# Altium schematic sheet Power.SchDoc: Power Section
size Tabloid; DocumentNumber: 3; SheetNumber: 3; SheetTotal: 3
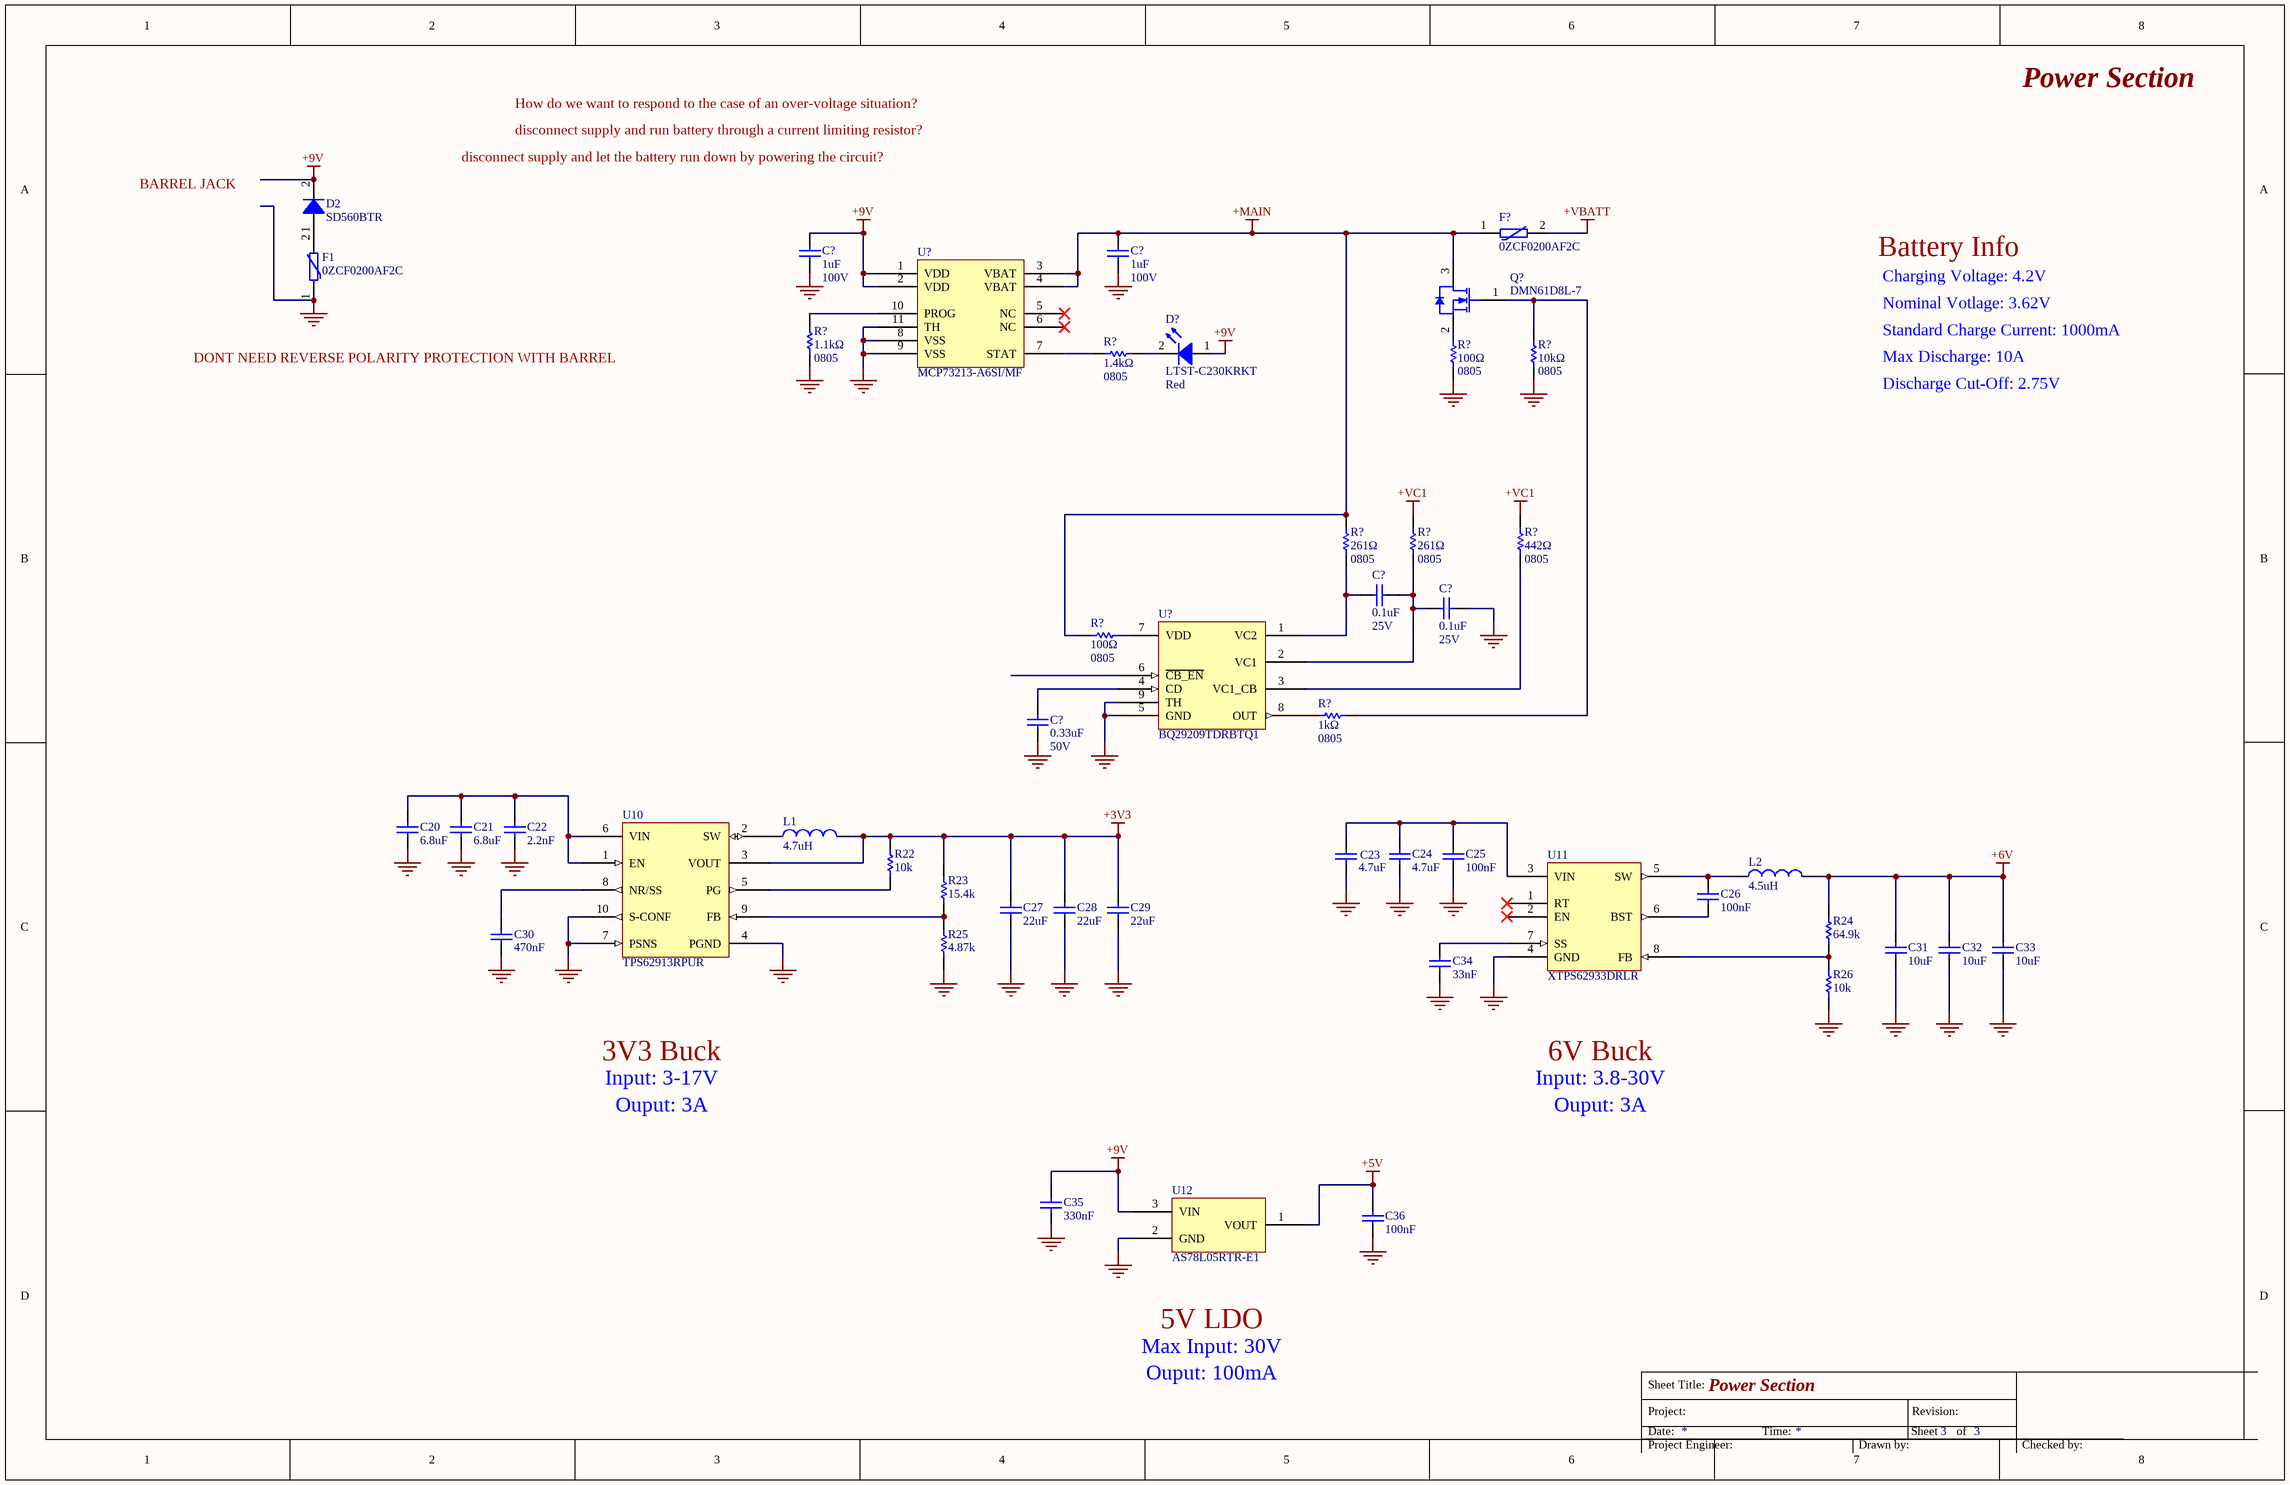
[diagram p0: Power.SchDoc]

## Parts
(Parts that share a designator on the sheet are numbered #1, #2 ... from top to bottom, then left to right.)
C20  6.8uF  [C0603]
C21  6.8uF  [C0603]
C22  2.2nF  [C0402]
C23  4.7uF  [C0805]
C24  4.7uF  [C0805]
C25  100nF  [C0402]
C26  100nF  [C0402]
C27  22uF  [C0603]
C28  22uF  [C0603]
C29  22uF  [C0603]
C30  470nF  [C0402]
C31  10uF  [C0805]
C32  10uF  [C0805]
C33  10uF  [C0805]
C34  33nF  [C0402]
C35  330nF  [C0402]
C36  100nF  [C0402]
C?#1  value 1uF  Voltage: 100V  [C0805]  (hidden comment: Ceramic Cap)
C?#2  value 1uF  Voltage: 100V  [C0805]  (hidden comment: Ceramic Cap)
C?#3  value 0.1uF  Voltage: 25V  [C0805]  (hidden comment: Ceramic Cap)
C?#4  value 0.1uF  Voltage: 25V  [C0805]  (hidden comment: Ceramic Cap)
C?#5  value 0.33uF  Voltage: 50V  [C0805]  (hidden comment: Ceramic Cap)
D2  SD560BTR  [DIOM4436X26N]
D?  Color: Red  [LTST-C230KRKT]  (hidden comment: LED)
F1  0ZCF0200AF2C  [RESC7451X08N]
F?  0ZCF0200AF2C  [RESC7451X08N]
L1  4.7uH  [SPM6530T-4R7M]
L2  4.5uH  [SRR1208-4R5ML]
Q?  DMN61D8L-7  [SOT90P240X102-3N]
R22  10k  [RESC1005X04N]
R23  15.4k  [RESC1005X04N]
R24  64.9k  [RESC1005X04N]
R25  4.87k  [RESC1005X04N]
R26  10k  [RESC1005X04N]
R?#1  value 1.1kΩ  Package/Footprint: 0805  [R0805]  (hidden comment: Resistor)
R?#2  value 1.4kΩ  Package/Footprint: 0805  [R0805]  (hidden comment: Resistor)
R?#3  value 100Ω  Package/Footprint: 0805  [R0805]  (hidden comment: Resistor)
R?#4  value 10kΩ  Package/Footprint: 0805  [R0805]  (hidden comment: Resistor)
R?#5  value 261Ω  Package/Footprint: 0805  [R0805]  (hidden comment: Resistor)
R?#6  value 261Ω  Package/Footprint: 0805  [R0805]  (hidden comment: Resistor)
R?#7  value 442Ω  Package/Footprint: 0805  [R0805]  (hidden comment: Resistor)
R?#8  value 100Ω  Package/Footprint: 0805  [R0805]  (hidden comment: Resistor)
R?#9  value 1kΩ  Package/Footprint: 0805  [R0805]  (hidden comment: Resistor)
U10  TPS62913RPUR  [TPS62913RPUR]
U11  XTPS62933DRLR  [XTPS62933DRLR]
U12  AS78L05RTR-E1  [SOT89-150P350X160-3N]
U?#1  MCP73213-A6SI/MF
U?#2  BQ29209TDRBTQ1

## Nets
+3V3: C27.2 C28.2 C29.2 L1.2 R22.2 R23.2 U10.3(VOUT)
+5V: C36.2 U12.1(VOUT)
+6V: C31.2 C32.2 C33.2 L2.2 R24.2
+9V: C35.2 C?#1.2 D2.2(K) D?.1(A) U12.3(VIN) U?#1.1(VDD) U?#1.2(VDD)
+MAIN: C?#2.2 F?.1(A) Q?.3(D) R?#5.2 R?#8.1 U?#1.3(VBAT) U?#1.4(VBAT)
+VBATT: F?.2(K)
+VC1: R?#6.2 R?#7.2
GND: C20.1 C21.1 C22.1 C23.1 C24.1 C25.1 C27.1 C28.1 C29.1 C30.1 C31.1 C32.1 C33.1 C34.1 C35.1 C36.1 C?#1.1 C?#2.1 C?#4.2 C?#5.1 F1.1(A) R25.1 R26.1 R?#1.1 R?#3.1 R?#4.1 U10.4(PGND) U10.7(PSNS) U10.10(S-CONF) U11.4(GND) U12.2(GND) U?#1.8(VSS) U?#1.9(VSS) U?#1.11(TH) U?#2.5(GND) U?#2.9(TH)
NetC20_2: C20.2 C21.2 C22.2 U10.1(EN) U10.6(VIN)
NetC23_2: C23.2 C24.2 C25.2 U11.3(VIN)
NetC26_1: C26.1 U11.6(BST)
NetC26_2: C26.2 L2.1 U11.5(SW)
NetC30_2: C30.2 U10.8(NR/SS)
NetC34_2: C34.2 U11.7(SS)
NetC?#3_1: C?#3.1 R?#5.1 U?#2.1(VC2)
NetC?#3_2: C?#3.2 C?#4.1 R?#6.1 U?#2.2(VC1)
NetC?#5_2: C?#5.2 U?#2.4(CD)
NetD2_1: D2.1(A) F1.2(K)
NetD?_2: D?.2(K) R?#2.2
NetL1_1: L1.1 U10.2(SW)
NetQ?_1: Q?.1(G) R?#4.2 R?#9.2
NetQ?_2: Q?.2(S) R?#3.2
NetR22_1: R22.1 U10.5(PG)
NetR23_1: R23.1 R25.2 U10.9(FB)
NetR24_1: R24.1 R26.2 U11.8(FB)
NetR?#1_2: R?#1.2 U?#1.10(PROG)
NetR?#2_1: R?#2.1 U?#1.7(STAT)
NetR?#7_1: R?#7.1 U?#2.3(VC1_CB)
NetR?#8_2: R?#8.2 U?#2.7(VDD)
NetR?#9_1: R?#9.1 U?#2.8(OUT)

Not connected (* = marked no-connect by the designer): U11 1(RT)* 2(EN)*; U?#1 5(NC)* 6(NC)*; U?#2 6(~{CB_EN})

## Notes on the sheet
- disconnect supply and let the battery run down by powering the circuit?
- How do we want to respond to the case of an over-voltage situation?
- disconnect supply and run battery through a current limiting resistor?
- BARREL JACK
- Charging Voltage: 4.2V
- Battery Info
- DONT NEED REVERSE POLARITY PROTECTION WITH BARREL
- Nominal Votlage: 3.62V
- Standard Charge Current: 1000mA
- Max Discharge: 10A
- Discharge Cut-Off: 2.75V
- 3V3 Buck
- Input: 3-17V
- Ouput: 3A
- 6V Buck
- Input: 3.8-30V
- 5V LDO
- Max Input: 30V
- Ouput: 100mA
- Sheet Title:
- Date:
- Project:
- Time:
- Sheet
- Revision:
- of
- Project Engineer:
- Drawn by:
- Checked by:

## Library data of the parts
C20 C21 = C1608JB1E685M080AC: General Purpose MLCC, 0603, JB, 25V, 6.8 F, 20%, 0.80mm; Manufacturer: TDK; Part Number: C1608JB1E685M080AC; Supplier 1: Digi-Key; Supplier Part Number 1: 445-11258-1-ND; Manufacturer Part Number: C1608JB1E685M080AC; Stock 1: 1791; Pricing 1: 1=0.67000, 10=0.47200, 50=0.35640, 100=0.31050, 500=0.23000, 1000=0.19550 (USD); Mount: Surface Mount; Case/Package: 0603; Case Code (Metric): 1608; Case Code (Imperial): 0603; Capacitance: 6.8uF; RoHS: Yes; Category: Ceramic Capacitors
C22 = C0402C222J3GEC7867: CAP CER 0402 2.2NF 25V C0G 5%; Manufacturer: KEMET; Part Number: C0402C222J3GEC7867; Supplier 1: Digi-Key; Supplier Part Number 1: 399-C0402C222J3GEC7867CT-ND; Manufacturer Part Number: C0402C222J3GEC7867; Stock 1: 6454; Pricing 1: 1=0.17000, 10=0.12300, 50=0.07000, 100=0.05800, 500=0.04068, 1000=0.03368, 2500=0.03135, 5000=0.02868 (USD); Capacitance: 2.2nF; RoHS: No; Category: Ceramic Capacitors
C23 C24 = CL21A475KOFNNNG: 4.7µF Ceramic Capacitor 16V % Samsung Electro-Mechanics CL21A475KOFNNNG; Tolerance: 10%; Dielectric: X5R; Part Number: CL21A475KOFNNNG; Supplier 1: Digi-Key; Supplier Part Number 1: 1276-6463-6-ND; Manufacturer: Samsung; Manufacturer Part Number: CL21A475KOFNNNG; Stock 1: 16459; Pricing 1: 1=0.12, 10=0.084, 100=0.0394, 500=0.0276, 1000=0.0229 (USD); Case/Package: 0805; Case Code (Metric): 2012; Case Code (Imperial): 0805; Min Operating Temperature: -55°C; Max Operating Temperature: 85°C; Capacitance: 4.7uF; Packaging: Tape and Reel; Voltage Rating: 16V; Length: 2mm; Height: 1.25mm; Width: 0.049inch; Thickness: 0.053inch; Depth: 1.25mm; Radiation Hardening: No
C25 C26 C36 = CL05A104KA5NNNC: Ceramic Capacitor, Multilayer, Ceramic, 25V, 10% +Tol, 10% -Tol, X5R, 15% TC, 0.1uF, Surface Mount, 0402; Manufacturer: Samsung; Part Number: CL05A104KA5NNNC; Supplier 1: Digi-Key; Supplier Part Number 1: 1276-1043-1-ND; Manufacturer Part Number: CL05A104KA5NNNC; Capacitance: 100nF
C27-C29 = CL10A226MPMNUBE: Ceramic Capacitor, Multilayer, Ceramic, 10V, 20% +Tol, 20% -Tol, X5R, 15% TC, 22uF, Surface Mount, 0603; Manufacturer: Samsung; Part Number: CL10A226MPMNUBE; Supplier 1: Digi-Key; Supplier Part Number 1: 1276-6751-2-ND; Manufacturer Part Number: CL10A226MPMNUBE; Mount: Surface Mount; Capacitance: 22uF
C30 = C0402C474K8RACTU: 0.47 µF ±10% 10V Ceramic Capacitor X7R 0402 (1005 Metric); Manufacturer: KEMET; Part Number: C0402C474K8RACTU; Supplier 1: Digi-Key; Supplier Part Number 1: 399-C0402C474K8RACTUCT-ND; Manufacturer Part Number: C0402C474K8RACTU; Stock 1: 12286; Pricing 1: 1=0.55000, 10=0.38900, 50=0.29440, 100=0.25650, 500=0.18998, 1000=0.16148, 2500=0.15198, 5000=0.14248 (USD); Capacitance: 470nF; RoHS: Yes; Category: Ceramic Capacitors
C31-C33 = CL21A106KAYNNNG: Ceramic Capacitor, Multilayer, Ceramic, 25V, 10% +Tol, 10% -Tol, X5R, 15% TC, 10uF, Surface Mount, 0805; Manufacturer: Samsung; Part Number: CL21A106KAYNNNG; Supplier 1: Digi-Key; Supplier Part Number 1: 1276-6454-6-ND; Manufacturer Part Number: CL21A106KAYNNNG; Mount: Surface Mount; Capacitance: 10uF
C34 = CGA2B3X7R1H333K050BB: CAP CER 0.033UF 50V X7R 0402; Manufacturer: TDK; Part Number: CGA2B3X7R1H333K050BB; Supplier 1: Digi-Key; Supplier Part Number 1: 445-6896-1-ND; Manufacturer Part Number: CGA2B3X7R1H333K050BB; Stock 1: 236424; Pricing 1: 1=0.11000, 10=0.07900, 50=0.04280, 100=0.03500, 500=0.02502, 1000=0.01966, 2500=0.01788, 5000=0.01644 (USD); Mount: Surface Mount; Case/Package: 0402; Case Code (Metric): 1005; Case Code (Imperial): 0402; Capacitance: 33nF; RoHS: Yes; Category: Ceramic Capacitors
C35 = C1005JB1V334M050BC: CAP CER 0.33UF 35V JB 0402; Manufacturer: TDK; Tolerance: 20%; Dielectric Material: Ceramic; Part Number: C1005JB1V334M050BC; Supplier 1: Digi-Key; Supplier Part Number 1: 445-11021-1-ND; Manufacturer Part Number: C1005JB1V334M050BC; Stock 1: 16942; Pricing 1: 1=0.18000, 10=0.12800, 50=0.07240, 100=0.06000, 500=0.04208, 1000=0.03484, 2500=0.03243, 5000=0.02967 (USD); Mount: Surface Mount; Case/Package: 0402; Case Code (Metric): 1005; Case Code (Imperial): 0402; Min Operating Temperature: -25°C; Max Operating Temperature: 85°C; Capacitance: 330nF; Packaging: Tape and Reel; Voltage Rating: 35V; RoHS: Yes; Category: Ceramic Capacitors; Weight: 0.001199oz; Package Quantity: 10000
C?#1 C?#2 = 08051C105K4Z2A: Manufacturer: KYOCERA AVX; Part Number: 08051C105K4Z2A; Package: 0805; Supplier: Digi-Key; Supplier Part Number: 478-12143-1-ND; Voltage Rating: 100V; Capacitance: 1uF
C?#3 C?#4 = CL21B104KACNNNC: Manufacturer: Samsung Electro-Mechanics; Part Number: CL21B104KACNNNC; Package: 0805; Supplier: Digi-Key; Supplier Part Number: 1276-1099-1-ND; Voltage Rating: 25V; Capacitance: 0.1uF
C?#5 = CL21B334KBFNFNE: Manufacturer: Samsung Electro-Mechanics; Part Number: CL21B334KBFNFNE; Package: 0805; Supplier: Digi-Key; Supplier Part Number: 1276-2959-1-ND; Voltage Rating: 50V; Capacitance: 0.33uF
D2 = SD560BTR: Diode Gen Purp 600V 5A Smb; Manufacturer: SMC; Part Number: SD560BTR; Manufacturer Part Number: SD560BTR; Pricing 1: 3000=0.08080, 9000=0.06710, 15000=0.06640, 30000=0.06550, 60000=0.06460 (USD); Supplier 1: Future Electronics; Supplier Part Number 1: 4059436; RoHS: No; Category: Industrial Control
D? = LTST-C230KRKT: Vf: 2V; Manufacturer Part Number: LTST-C230KRKT; Part Number: LTST-C230KRKT; Colour: Red; Size: 3.20mm L x 1.60mm W; Supplier: Digi-Key; Supplier Part Number: 160-1457-1-ND
F1 F? = 0ZCF0200AF2C: PTC RESET FUSE 24V 2A 2920; Manufacturer: Bel; Part Number: 0ZCF0200AF2C; Supplier 1: Digi-Key; Supplier Part Number 1: 507-1749-1-ND; Manufacturer Part Number: 0ZCF0200AF2C; Stock 1: 88016; Pricing 1: 1=0.26000, 5=0.24800, 10=0.23700, 50=0.21160, 100=0.19710, 250=0.17520, 500=0.14600, 1000=0.13870 (USD); Case Code (Metric): 7351; Case Code (Imperial): 2920; RoHS: Yes; Category: PTC Resettable Fuses
L1 = SPM6530T-4R7M: Ind Power Shielded Wirewound 4.7uH 20% 100KHz Metal 5.6A T/R; Manufacturer: TDK; DC Resistance (DCR): 39.4mR; Rated Current-Max: 6.2A; Part Number: SPM6530T-4R7M; Component Type: Inductor; ComponentLink1Description: https://datasheet.ciiva.com/15992/e531-spm6530-15992145.pdf?src-supplier=Onlinecomponents.com; ComponentLink1URL: https://datasheet.ciiva.com/15992/e531-spm6530-15992145.pdf?src-supplier=Onlinecomponents.com; ComponentLink2Description: https://datasheet.ciiva.com/8045/1649093-8045744.pdf?src-supplier=Element14; ComponentLink2URL: https://datasheet.ciiva.com/8045/1649093-8045744.pdf?src-supplier=Element14; Supplier 1: Digi-Key; Supplier Part Number 1: 445-4120-1-ND; Manufacturer Part Number: SPM6530T-4R7M; Stock 1: 2561; Pricing 1: 1=1.35000, 10=1.25100, 25=1.15520, 50=0.96240, 100=0.90480, 250=0.80848, 500=0.69300 (USD); Case/Package: Nonstandard; Weight: 0.000564oz; Core Material: Metal; Case Code (Metric): 3225; Case Code (Imperial): 1210; Min Operating Temperature: -40°C; Max Operating Temperature: 125°C; Packaging: Tape and Reel; Tolerance: 20%; Current Rating: 5.6A; Shielding: Shielded; Composition: Wirewound; Inductance: 4.7uH; Test Frequency: 100kHz; Inductance Tolerance: 20%; Package Quantity: 1; Max DC Current: 5.6A; DC Current: 5.6A; Military Standard: Not; Termination: SMD/SMT; Length: 0.28inch; Height: 3mm; Width: 0.256inch; Height - Seated (Max): 0.118inch; Depth: 6.8mm; REACH SVHC: No SVHC; Lead Free: Lead Free; ComponentLink3URL: https://datasheet.ciiva.com/1047/e531-spm-1047410.pdf?src-supplier=Digi-Key; ComponentLink3Description: https://datasheet.ciiva.com/1047/e531-spm-1047410.pdf?src-supplier=Digi-Key; Mount: Surface Mount; ComponentLink4URL: https://datasheet.ciiva.com/1047/e531-spm-1047411.pdf?src-supplier=Digi-Key; ComponentLink4Description: https://datasheet.ciiva.com/1047/e531-spm-1047411.pdf?src-supplier=Digi-Key; ComponentLink5URL: https://datasheet.ciiva.com/1047/e531-spm-1047412.pdf?src-supplier=Digi-Key; ComponentLink5Description: https://datasheet.ciiva.com/1047/e531-spm-1047412.pdf?src-supplier=Digi-Key; Number of Pins: 2; Inductance-Nom (L): 4.7uH; RoHS Compliant: Yes; ComponentLink6URL: https://datasheet.ciiva.com/8498/e531-spm-8498189.pdf?src-supplier=Avnet; ComponentLink6Description: https://datasheet.ciiva.com/8498/e531-spm-8498189.pdf?src-supplier=Avnet; ComponentLink7URL: https://datasheet.ciiva.com/16488/e531-spm-16488759.pdf?src-supplier=Future+Electronics; ComponentLink7Description: https://datasheet.ciiva.com/16488/e531-spm-16488759.pdf?src-supplier=Future+Electronics; RoHS: Yes; Category: Fixed Inductors; Saturation Current: 6.2A; Resistor Type: Wirewound; RMS Current (Irms): 5.6A; Series: SPM; ComponentLink8URL: https://datasheet.ciiva.com/28425/e531-spm-28425948.pdf?src-supplier=Element14; ComponentLink8Description: https://datasheet.ciiva.com/28425/e531-spm-28425948.pdf?src-supplier=Element14
L2 = SRR1208-4R5ML: Inductor;  Filter;  Ind 4.5uH;  Tol 20%;  Cur 6.5A;  SMT;  Case 1208;  DCR 0.014 Ohms; Manufacturer: Bourns; Core Material: Ferrite; Shielding: Shielded; Self Resonant Frequency: 30MHz; DC Resistance (DCR): 14mR; Test Frequency: 1kHz; Saturation Current: 10A; Material: Steel; Q Factor: 24; Part Number: SRR1208-4R5ML; Component Type: Inductor; ComponentLink1Description: https://datasheet.ciiva.com/11803/0900766b80defdeb-11803005.pdf?src-supplier=RSComponents; ComponentLink1URL: https://datasheet.ciiva.com/11803/0900766b80defdeb-11803005.pdf?src-supplier=RSComponents; ComponentLink2Description: https://datasheet.ciiva.com/1060/srr1208-1060209.pdf?src-supplier=Digi-Key; ComponentLink2URL: https://datasheet.ciiva.com/1060/srr1208-1060209.pdf?src-supplier=Digi-Key; Supplier 1: Digi-Key; Supplier Part Number 1: SRR1208-4R5MLCT-ND; Manufacturer Part Number: SRR1208-4R5ML; Stock 1: 2833; Pricing 1: 1=1.14000, 10=1.05400, 25=0.97320, 50=0.81100, 100=0.76230 (USD); Case/Package: 1208; Weight: 0.000564oz; Case Code (Metric): 3225; Case Code (Imperial): 1210; Min Operating Temperature: -40°C; Max Operating Temperature: 125°C; Packaging: Tape and Reel; Tolerance: 20%; Current Rating: 6.5A; Composition: Wirewound; Inductance: 4.5uH; Inductance Tolerance: 20%; Package Quantity: 400; Max DC Current: 6.5A; DC Current: 6.5A; Military Standard: Not; Termination: SMD/SMT; Length: 12.7mm; Height: 8.5mm; Width: 0.5inch; Height - Seated (Max): 0.335inch; Depth: 13mm; REACH SVHC: No SVHC; ComponentLink3URL: https://datasheet.ciiva.com/1060/srr1208-1060210.pdf?src-supplier=Digi-Key; ComponentLink3Description: https://datasheet.ciiva.com/1060/srr1208-1060210.pdf?src-supplier=Digi-Key; Mount: Surface Mount; ComponentLink4URL: https://datasheet.ciiva.com/30091/srr1208-30091109.pdf?src-supplier=Onlinecomponents.com; ComponentLink4Description: https://datasheet.ciiva.com/30091/srr1208-30091109.pdf?src-supplier=Onlinecomponents.com; ComponentLink5URL: https://datasheet.ciiva.com/17285/srr1208-17285910.pdf?src-supplier=Avnet+Europe; ComponentLink5Description: https://datasheet.ciiva.com/17285/srr1208-17285910.pdf?src-supplier=Avnet+Europe; RoHS Compliant: Yes; ComponentLink6URL: https://datasheet.ciiva.com/7849/1483756-7849582.pdf?src-supplier=Element14; ComponentLink6Description: https://datasheet.ciiva.com/7849/1483756-7849582.pdf?src-supplier=Element14; RoHS: Yes; Category: Fixed Inductors; Resistor Type: Wirewound; RMS Current (Irms): 6.5A; Series: SRR1208; Frequency: 30MHz; Resistance: 14MR; Sample Rate (Hz): 1kHz
Q? = DMN61D8L-7: MOSFET N-CH 60V 470MA SOT23; Manufacturer: Diodes; Rise Time: 1.8ns; Turn-On Delay Time: 2.2ns; Turn-Off Delay Time: 5.3ns; Fall Time: 5.1ns; Threshold Voltage: 1.25V; Gate to Source Voltage (Vgs): 20V; Number of Channels: 1; Drain to Source Breakdown Voltage: 50V; Drain to Source Resistance: 3.5R; Part Number: DMN61D8L-7; Supplier 1: Digi-Key; Supplier Part Number 1: DMN61D8L-7DICT-ND; Manufacturer Part Number: DMN61D8L-7; Mount: Surface Mount; Case/Package: SOT-23; Weight: 0.03g; Package Quantity: 3000; REACH SVHC: No SVHC; Stock: 8238; Pricing: 1=0.56000, 10=0.48300, 25=0.45040, 100=0.33460, 500=0.26126, 1000=0.21236 (USD)
R22 R26 = RC0402FR-0710KL: RES SMD 10K OHM 1% 1/16W 0402; Manufacturer: Yageo; Power Rating: 62.5mW; Voltage Rating: 50V; Temperature Coefficient: 100ppm/°C; Part Number: RC0402FR-0710KL; Value: 10k; Supplier 1: Digi-Key; Supplier Part Number 1: 311-10.0KLRCT-ND; Manufacturer Part Number: RC0402FR-0710KL; Stock 1: 14034353; Pricing 1: 1=0.1, 10=0.014, 100=0.0056, 1000=0.0025, 2500=0.0022, 5000=0.0018 (USD); Case/Package: 0402; Case Code (Metric): 1005; Case Code (Imperial): 0402; Min Operating Temperature: -55°C; Max Operating Temperature: 155°C; Packaging: Tape and Reel; Tolerance: 1%; Composition: Thick Film; Resistance: 10k; Military Standard: Not; Length: 1mm; Height: 0.32mm; Width: 0.5mm; Depth: 0.5mm; Lead Pitch: 0.2mm; REACH SVHC: No SVHC; Lead Free: Lead Free
  R22: ComponentLink1URL: https://datasheet.ciiva.com/7660/38568-7660787.pdf; ComponentLink1Description: https://datasheet.ciiva.com/7660/38568-7660787.pdf; ComponentLink2URL: https://datasheet.ciiva.com/7849/1784430-7849813.pdf; ComponentLink2Description: https://datasheet.ciiva.com/7849/1784430-7849813.pdf; ComponentLink3URL: https://datasheet.ciiva.com/11808/0900766b80c66297-11808309.pdf; ComponentLink3Description: https://datasheet.ciiva.com/11808/0900766b80c66297-11808309.pdf; ComponentLink4URL: https://datasheet.ciiva.com/16744/pyu-rc0402-51-rohs-l-6-r-16744005.pdf; ComponentLink4Description: https://datasheet.ciiva.com/16744/pyu-rc0402-51-rohs-l-6-r-16744005.pdf; ComponentLink5URL: https://datasheet.ciiva.com/7849/1686128-7849814.pdf; ComponentLink5Description: https://datasheet.ciiva.com/7849/1686128-7849814.pdf; ComponentLink6URL: https://datasheet.ciiva.com/7849/1784430-7849815.pdf; ComponentLink6Description: https://datasheet.ciiva.com/7849/1784430-7849815.pdf; ComponentLink7URL: https://datasheet.ciiva.com/22747/1018594-22747512.pdf; ComponentLink7Description: https://datasheet.ciiva.com/22747/1018594-22747512.pdf; ComponentLink8URL: https://datasheet.ciiva.com/12667/pyu-rc0402-51-rohs-l-6-r-12667067.pdf; ComponentLink8Description: https://datasheet.ciiva.com/12667/pyu-rc0402-51-rohs-l-6-r-12667067.pdf; ComponentLink9URL: https://datasheet.ciiva.com/7983/1018594-7983486.pdf; ComponentLink9Description: https://datasheet.ciiva.com/7983/1018594-7983486.pdf
R23 = TNPW040215K4BEED: RES 15.4K OHM 0.1% 1/10W 0402; Manufacturer: Vishay Dale; Part Number: TNPW040215K4BEED; Supplier 1: Digi-Key; Supplier Part Number 1: 541-2078-1-ND; Manufacturer Part Number: TNPW040215K4BEED; Resistance: 15.4k
R24 = RC0402FR-0764K9L: RES 64.9K OHM 1% 1/16W 0402; Manufacturer: Yageo; Part Number: RC0402FR-0764K9L; Supplier 1: Digi-Key; Supplier Part Number 1: 311-64.9KLRCT-ND; Manufacturer Part Number: RC0402FR-0764K9L; Resistance: 64.9k
R25 = RC0402FR-074K87L: Res Thick Film 0402 4.87K Ohm 1% 1/16W 100ppm/C Molded SMD SMD Paper T/R; Manufacturer: Yageo; Power Rating: 62.5mW; Voltage Rating: 50V; Temperature Coefficient: 100ppm/°C; Max Power Dissipation: 63mW; Part Number: RC0402FR-074K87L; Supplier 1: Digi-Key; Supplier Part Number 1: YAG3175CT-ND; Manufacturer Part Number: RC0402FR-074K87L; Stock 1: 143540; Pricing 1: 1=0.10000, 10=0.01600, 100=0.00660, 1000=0.00299, 2500=0.00259, 5000=0.00214 (USD); Case/Package: 0402; Case Code (Metric): 1005; Case Code (Imperial): 0402; Min Operating Temperature: -55°C; Max Operating Temperature: 155°C; Packaging: Tape and Reel; Tolerance: 1%; Resistance: 4.87k; Number of Terminations: 2; Termination: SMD/SMT; Voltage Rating (DC): 50V; Contact Plating: Tin,Matte,Lead; Features: Moisture Resistant; Resistor Type: Thick Film; Size Code: 0402; RoHS: Yes; Category: Chip SMD Resistors
R?#1 = RMCF0805FT1K10: Part Number: RMCF0805FT1K10; Manufacturer: RMCF0805FT1K10; Supplier: Digi-Key; Supplier Part Number: RMCF0805FT1K10CT-ND; Resistance: 1.1kΩ; Package: 0805
R?#2 = RC0805FR-071K4L: Manufacturer: Yageo; Part Number: RC0805FR-071K4L; Supplier: Digi-Key; Supplier Part Number: 311-1.40KCRCT-ND; Resistance: 1.4kΩ; Package: 0805
R?#3 R?#8 = RC0805FR-07100RL: Manufacturer: Yageo; Part Number: RC0805FR-07100RL; Supplier: Digi-Key; Supplier Part Number: 311-100CRCT-ND; Resistance: 100Ω; Package: 0805
R?#4 = RC0805JR-0710KL: Manufacturer: Yageo; Part Number: RC0805JR-0710KL; Supplier: Digi-Key; Supplier Part Number: 311-10KARTR-ND; Resistance: 10kΩ; Package: 0805
R?#5 R?#6 = RMCF0805FT261R: Manufacturer: Stackpole Electronics Inc; Part Number: RMCF0805FT261R; Supplier: Digi-Key; Supplier Part Number: RMCF0805FT261RCT-ND; Resistance: 261Ω; Package: 0805
R?#7 = RC0805FR-07442RL: Manufacturer: Yageo; Part Number: RC0805FR-07442RL; Supplier: Digi-Key; Supplier Part Number: 311-442CRCT-ND; Resistance: 442Ω; Package: 0805
R?#9 = RMCF0805FT1K00: Manufacturer: Stackpole Electronics Inc; Part Number: RMCF0805FT1K00; Supplier: Digi-Key; Supplier Part Number: RMCF0805FT1K00CT-ND; Resistance: 1kΩ; Package: 0805
U10 = TPS62913RPUR: Manufacturer: Texas Instruments; Part Number: TPS62913RPUR; Supplier 1: Digi-Key; Supplier Part Number 1: 296-TPS62913RPURCT-ND; Manufacturer Part Number: TPS62913RPUR; RoHS: Yes; Stock 1: 616; Pricing 1: 1=3.43000, 10=3.08300, 25=2.91440, 100=2.52590, 250=2.39636, 500=2.15024, 1000=2.13850 (USD); Category: Voltage Regulators - Switching
U11 = XTPS62933DRLR: 3.8-V to 30-V, 3-A, 200-kHz to 2.2-MHz, low-IQ synchronous buck converter in SOT-583 package; Manufacturer: Texas Instruments; Part Number: XTPS62933DRLR; Supplier 1: TI; Supplier Part Number 1: XTPS62933DRLR; Manufacturer Part Number: XTPS62933DRLR
U12 = AS78L05RTR-E1: Standard Regulator Pos 5V 0.1A 3-Pin SOT-89 T/R; Manufacturer: Diodes; Output Type: Fixed; Output Current: 100mA; Dropout Voltage: 1.8V; Number of Regulators: 1; Min Input Voltage: 7V; Max Input Voltage: 30V; Part Number: AS78L05RTR-E1; Supplier 1: Digi-Key; Supplier Part Number 1: AS78L05RTR-E1DICT-ND; Manufacturer Part Number: AS78L05RTR-E1; Mount: Surface Mount; RoHS: Yes; Stock 1: 161310; Pricing 1: 1=0.41000, 10=0.30600, 25=0.27560, 100=0.19050, 250=0.16044, 500=0.13036 (USD); Category: Voltage Regulators - Linear; Number of Pins: 3; Min Operating Temperature: -40°C; Max Operating Temperature: 125°C; Package Quantity: 1000; Packaging: Tape and Reel; ComponentLink1URL: https://datasheet.ciiva.com/30016/as78lxx-30016635.pdf?src-supplier=Avnet; ComponentLink1Description: https://datasheet.ciiva.com/30016/as78lxx-30016635.pdf?src-supplier=Avnet; Case/Package: SOT-89-3; Output Voltage: 5V; RoHS Compliant: Yes; Number of Outputs: 1